# EAGLE design ui_board (EAGLE 8.7.1)
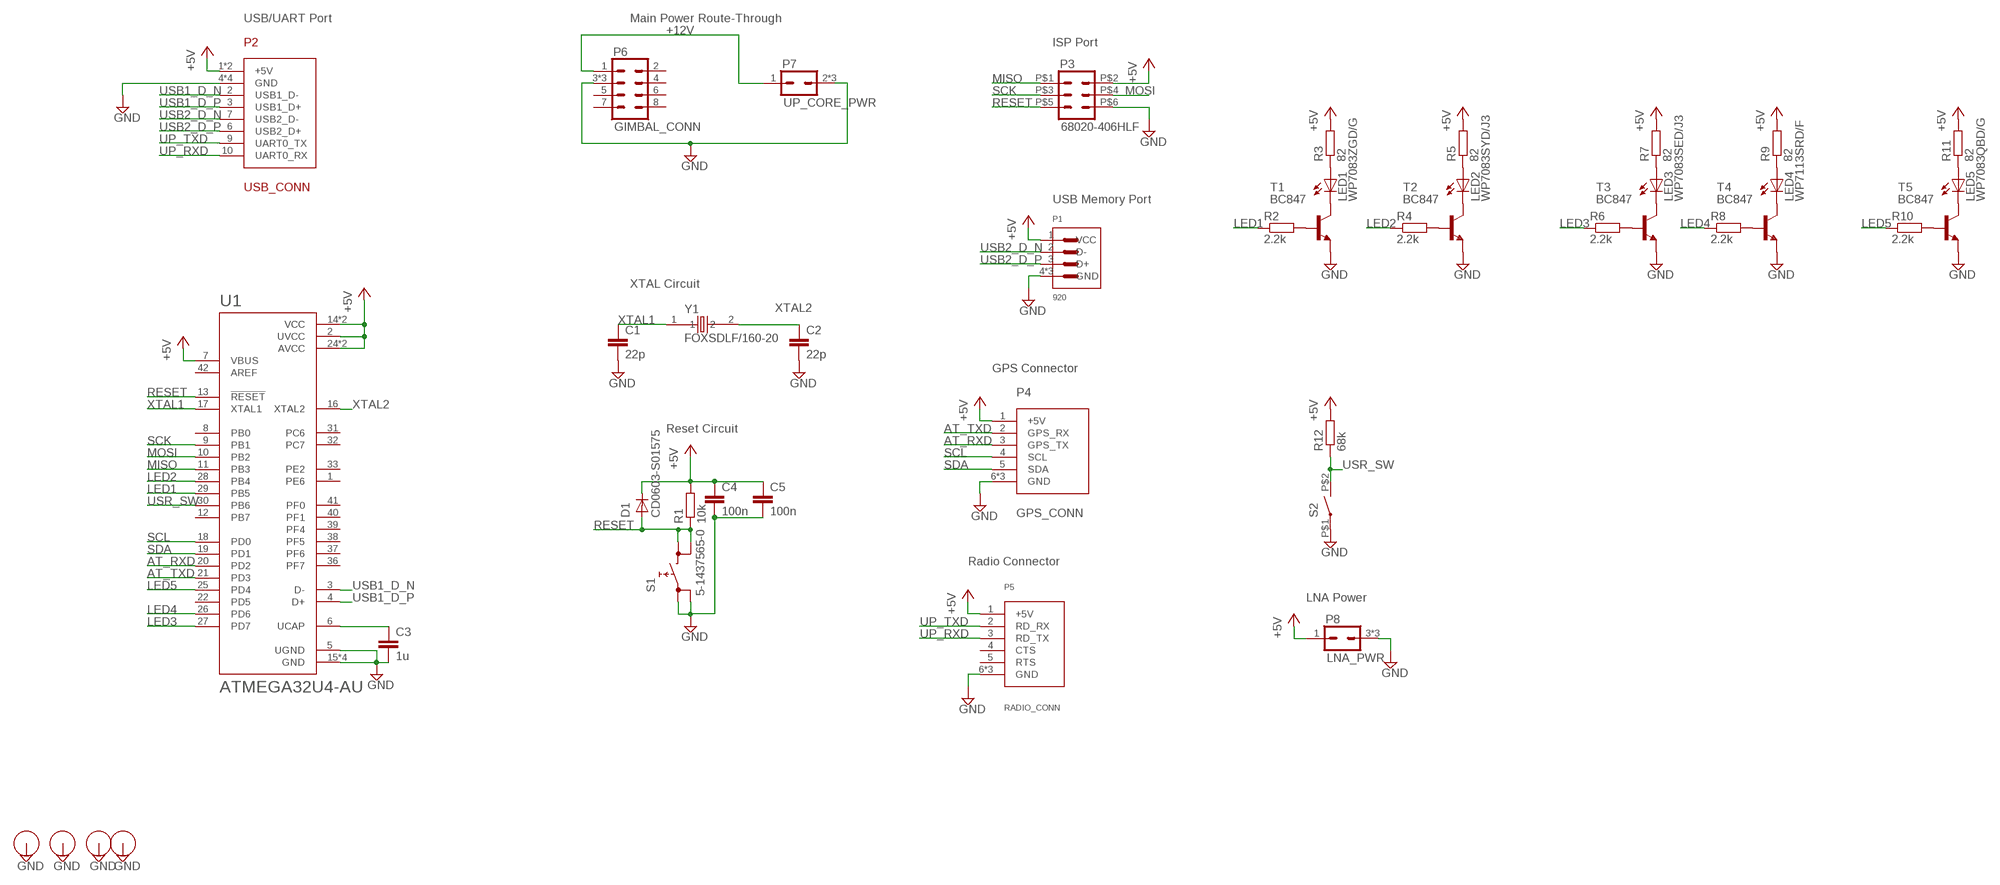
[diagram p0: schematic, sheet 1]

## Parts
C1  22p  C-EUC0805  [C0805]
C2  22p  C-EUC0805  [C0805]
C3  1u  C-EUC0805  [C0805]
C4  100n  C-EUC0805  [C0805]
C5  100n  C-EUC0805  [C0805]
D1  CD0603-S01575  [D0603]
LED1  WP7083ZGD/G  LED5MM  [LED5MM]
LED2  WP7083SYD/J3  LED5MM  [LED5MM]
LED3  WP7083SED/J3  LED5MM  [LED5MM]
LED4  WP7113SRD/F  LED5MM  [LED5MM]
LED5  WP7083QBD/G  LED5MM  [LED5MM]
P1  920  [USB_THRU]
P2  USB_CONN  [SM10B-SRSS-TB]
P3  68020-406HLF  [2X3_THRU]
P4  GPS_CONN  [SM06B-GHS-TB]
P5  RADIO_CONN  [DF13C-6P-1.25V]
P6  GIMBAL_CONN  [GIMBAL_CONN]
P7  UP_CORE_PWR  [SM02B-GHS-TB]
P8  LNA_PWR  [SM03B-GHS-TB]
R1  10k  R-EU_R0805  [R0805]
R2  2.2k  R-EU_R0805  [R0805]
R3  82  R-EU_R0805  [R0805]
R4  2.2k  R-EU_R0805  [R0805]
R5  82  R-EU_R0805  [R0805]
R6  2.2k  R-EU_R0805  [R0805]
R7  82  R-EU_R0805  [R0805]
R8  2.2k  R-EU_R0805  [R0805]
R9  82  R-EU_R0805  [R0805]
R10  2.2k  R-EU_R0805  [R0805]
R11  82  R-EU_R0805  [R0805]
R12  68k  R-EU_R0805  [R0805]
S1  5-1437565-0  [5-1437565-0]
S2  2267078-1  [2267078-1]
T1  BC847  [SOT23]
T2  BC847  [SOT23]
T3  BC847  [SOT23]
T4  BC847  [SOT23]
T5  BC847  [SOT23]
U1  ATMEGA32U4-AU  [QFP80P1200X1200X120-44N]
U$1  MOUNT_PAD  [MOUNT_PAD]
U$3  MOUNT_PAD  [MOUNT_PAD]
U$4  MOUNT_PAD  [MOUNT_PAD]
U$5  MOUNT_PAD  [MOUNT_PAD]
Y1  FOXSDLF/160-20  [XTAL1170X500X450]

## Nets
+5V: C4.1 C5.1 D1.P$1(C) P1.1(VCC) P2.1(+5V) P2.5(+5V) P3.P$2 P4.1(+5V) P5.1(+5V) P8.1 R1.2 R3.2 R5.2 R7.2 R9.2 R11.2 R12.2 U1.2(UVCC) U1.7(VBUS) U1.14(VCC) U1.24(AVCC) U1.34(VCC) U1.44(AVCC)
+12V: P6.1 P7.1
AT_RXD: P4.3(GPS_TX) U1.20(PD2)
AT_TXD: P4.2(GPS_RX) U1.21(PD3)
GND: C1.2 C2.2 C3.2 C4.2 C5.2 P1.4(GND) P1.5(GND) P1.6(GND) P2.4(GND) P2.8(GND) P2.G1(GND) P2.G2(GND) P3.P$6 P4.6(GND) P4.G1(GND) P4.G2(GND) P5.6(GND) P5.G1(GND) P5.G2(GND) P6.3 P6.GND@1 P6.GND@2 P7.2 P7.G1 P7.G2 P8.3 P8.G1 P8.G2 S1.P$1 S1.P$2 S2.P$1(P) T1.2(E) T2.2(E) T3.2(E) T4.2(E) T5.2(E) U1.5(UGND) U1.15(GND) U1.23(GND) U1.35(GND) U1.43(GND) U$1.P$1(GND) U$3.P$1(GND) U$4.P$1(GND) U$5.P$1(GND)
LED1: R2.1 U1.29(PB5)
LED2: R4.1 U1.28(PB4)
LED3: R6.1 U1.27(PD7)
LED4: R8.1 U1.26(PD6)
LED5: R10.1 U1.25(PD4)
MISO: P3.P$1 U1.11(PB3)
MOSI: P3.P$4 U1.10(PB2)
N$1: LED1.K(C) T1.3(C)
N$2: C3.1 U1.6(UCAP)
N$3: LED2.K(C) T2.3(C)
N$4: LED3.K(C) T3.3(C)
N$5: LED4.K(C) T4.3(C)
N$6: LED5.K(C) T5.3(C)
N$7: R2.2 T1.1(B)
N$8: LED1.A R3.1
N$9: R4.2 T2.1(B)
N$10: LED2.A R5.1
N$11: R6.2 T3.1(B)
N$12: LED3.A R7.1
N$13: R8.2 T4.1(B)
N$14: LED4.A R9.1
N$15: R10.2 T5.1(B)
N$16: LED5.A R11.1
RESET: D1.P$2(A) P3.P$5 R1.1 S1.P$3 S1.P$4 U1.13(!RESET)
SCK: P3.P$3 U1.9(PB1)
SCL: P4.4(SCL) U1.18(PD0)
SDA: P4.5(SDA) U1.19(PD1)
UP_RXD: P2.10(UART0_RX) P5.3(RD_TX)
UP_TXD: P2.9(UART0_TX) P5.2(RD_RX)
USB1_D_N [USB]: P2.2(USB1_D-) U1.3(D-)
USB1_D_P [USB]: P2.3(USB1_D+) U1.4(D+)
USB2_D_N [USB]: P1.2(D-) P2.7(USB2_D-)
USB2_D_P [USB]: P1.3(D+) P2.6(USB2_D+)
USR_SW: R12.1 S2.P$2(S) U1.30(PB6)
XTAL1: C1.1 U1.17(XTAL1) Y1.1
XTAL2: C2.1 U1.16(XTAL2) Y1.2
Unconnected: P5.4(CTS) P5.5(RTS) P6.2 P6.4 P6.5 P6.6 P6.7 P6.8 U1.1(PE6) U1.8(PB0) U1.12(PB7) U1.22(PD5) U1.31(PC6) U1.32(PC7) U1.33(PE2) U1.36(PF7) U1.37(PF6) U1.38(PF5) U1.39(PF4) U1.40(PF1) U1.41(PF0) U1.42(AREF)

## Notes on the sheet
- USB/UART Port | Main Power Route-Through
- ISP Port
- USB Memory Port
- XTAL Circuit
- GPS Connector
- Reset Circuit
- Radio Connector
- LNA Power

## Library data of the parts
C1 C2 = resistor:C-EU: CAPACITOR, European symbol
C3-C5 = rcl:C-EU: CAPACITOR, European symbol; SPICEPREFIX: C
D1 = rct_ui_board:CD0603-S01575
LED1-LED5 = led:LED: LED OSRAM: - CHIPLED LG R971, LG N971, LY N971, LG Q971, LY Q971, LO R971, LY R971 LH N974, LH R974 LS Q976, LO Q976, LY Q976 LO Q996 - Hyper CHIPLED LW Q18S LB Q993, LB Q99A, LB R99A - SideLED LS A670, LO A670, LY A670, LG A670, LP A670 LB A673, LV A673, LT A673, LW A673 LH A674 LY A675 LS A676, LA A676, LO A676, LY A676, LW A676 LS A679, LY A679, LG A679 - Hyper Micro SIDELED® LS Y876, LA Y876, LO Y876, LY Y876 LT Y87S - SmartLED LW L88C, LW L88S LB L89C, LB L89S, LG L890 LS L89K, LO L89K, LY L89K LS L896, LA L896, LO L896, LY L896 - TOPLED LS T670, LO T670, LY T670, LG T670, LP T670 LSG T670, LSP T670, LSY T670, LOP T670, LYG T670 LG T671, LOG T671, LSG T671 LB T673, LV T673, LT T673, LW T673 LH T674 LS T676, LA T676, LO T676, LY T676, LB T676, LH T676, LSB T676, LW T676 LB T67C, LV T67C, LT T67C, LS T67K, LO T67K, LY T67K, LW E67C LS E67B, LA E67B, LO E67B, LY E67B, LB E67C, LV E67C, LT E67C LW T67C LS T679, LY T679, LG T679 LS T770, LO T770, LY T770, LG T770, LP T770 LB T773, LV T773, LT T773, LW T773 LH T774 LS E675, LA E675, LY E675, LS T675 LS T776, LA T776, LO T776, LY T776, LB T776 LHGB T686 LT T68C, LB T68C - Hyper Mini TOPLED® LB M676 - Mini TOPLED Santana® LG M470 LS M47K, LO M47K, LY M47K Source: http://www.osram.convergy.de LUXEON: - LUMILED® LXK2-PW12-R00, LXK2-PW12-S00, LXK2-PW14-U00, LXK2-PW14-V00 LXK2-PM12-R00, LXK2-PM12-S00, LXK2-PM14-U00 LXK2-PE12-Q00, LXK2-PE12-R00, LXK2-PE12-S00, LXK2-PE14-T00, LXK2-PE14-U00 LXK2-PB12-K00, LXK2-PB12-L00, LXK2-PB12-M00, LXK2-PB14-N00, LXK2-PB14-P00, LXK2-PB14-Q00 LXK2-PR12-L00, LXK2-PR12-M00, LXK2-PR14-Q00, LXK2-PR14-R00 LXK2-PD12-Q00, LXK2-PD12-R00, LXK2-PD12-S00 LXK2-PH12-R00, LXK2-PH12-S00 LXK2-PL12-P00, LXK2-PL12-Q00, LXK2-PL12-R00 Source: www.luxeon.com KINGBRIGHT: KA-3528ASYC Source: www.kingbright.com
P1 = rct_ui_board:920
P2 = rct_ui_board:USB_CONN
P3 = rct_ui_board:68020-406HLF
P4 = rct_ui_board:GPS_CONN
P5 = rct_ui_board:RADIO_CONN
P6 = rct_ui_board:GIMBAL_CONN
P7 = rct_ui_board:UP_CORE_PWR
P8 = rct_ui_board:LNA_PWR
R1-R12 = rcl:R-EU_: RESISTOR, European symbol; SPICEPREFIX: R
S1 = rct_ui_board:5-1437565-0
S2 = rct_ui_board:2267078-1
T1-T5 = transistor:BC847: NPN TRANSISTOR
U1 = Common-Parts-Library-Eagle:ATMEGA32U4-AU: ATmega Series 16 MHz 32 KB Flash 2.5 KB SRAM 8-Bit Microcontroller - TQFP-44; MANUFACTURER: Atmel
U$1 U$3-U$5 = rct_ui_board:MOUNT_PAD
Y1 = Common-Parts-Library-Eagle:FOXSDLF/160-20: Microprocessor, Crystal; 16 Mhz; + 30 Ppm @ Degc; 7 Pf (Max.); 20 Pf; -20 Deg; MANUFACTURER: Fox Electronics

## Board
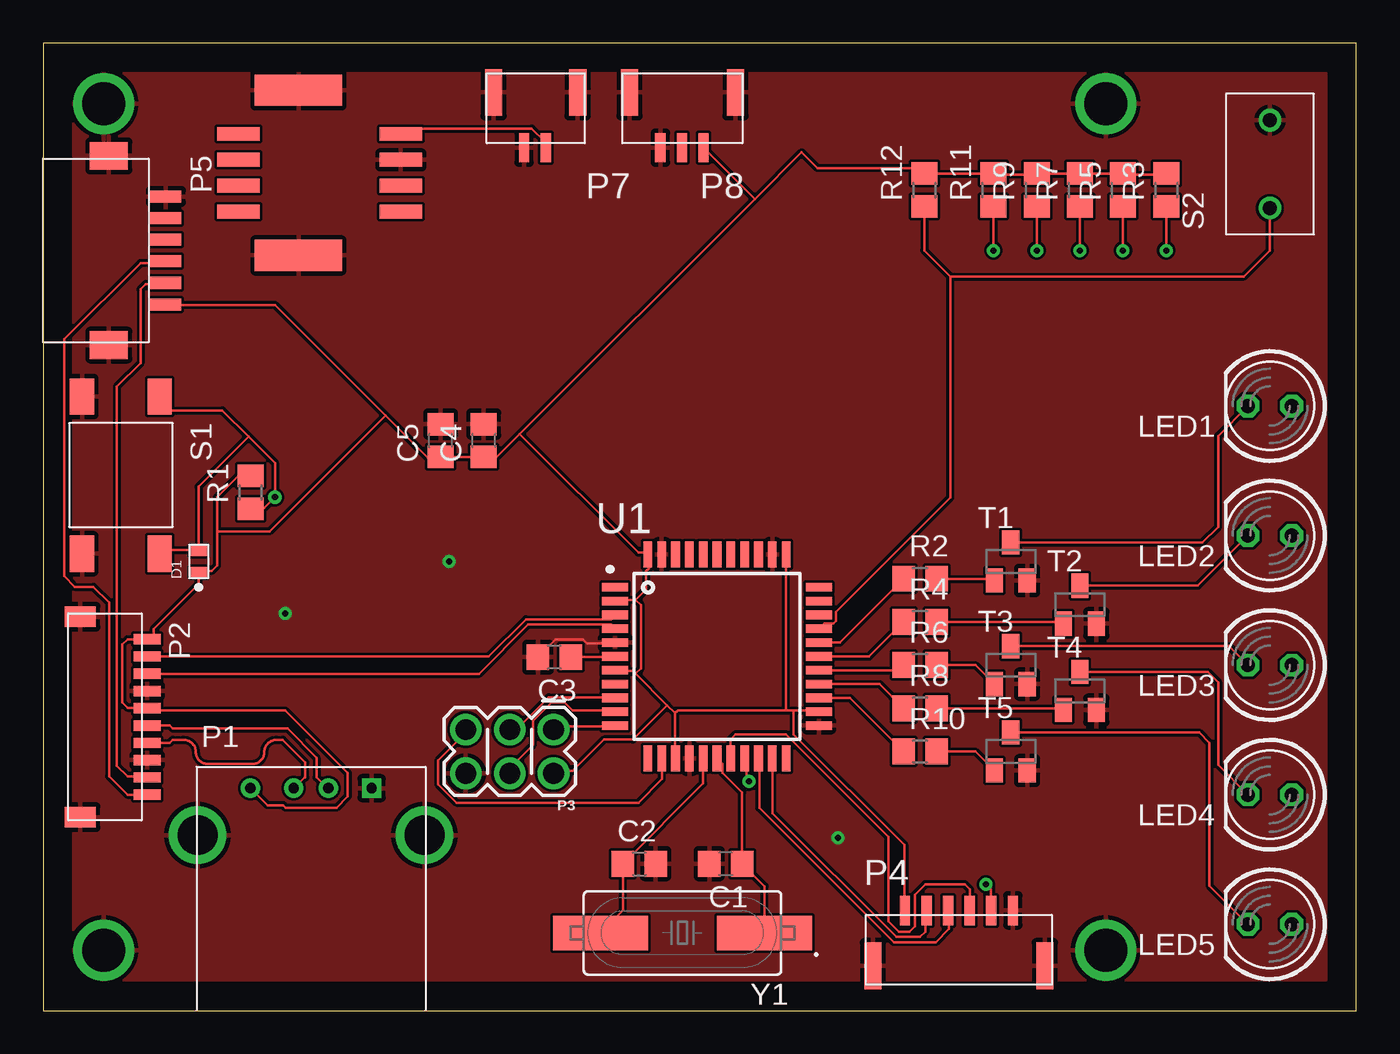
[diagram p1: board, top side]
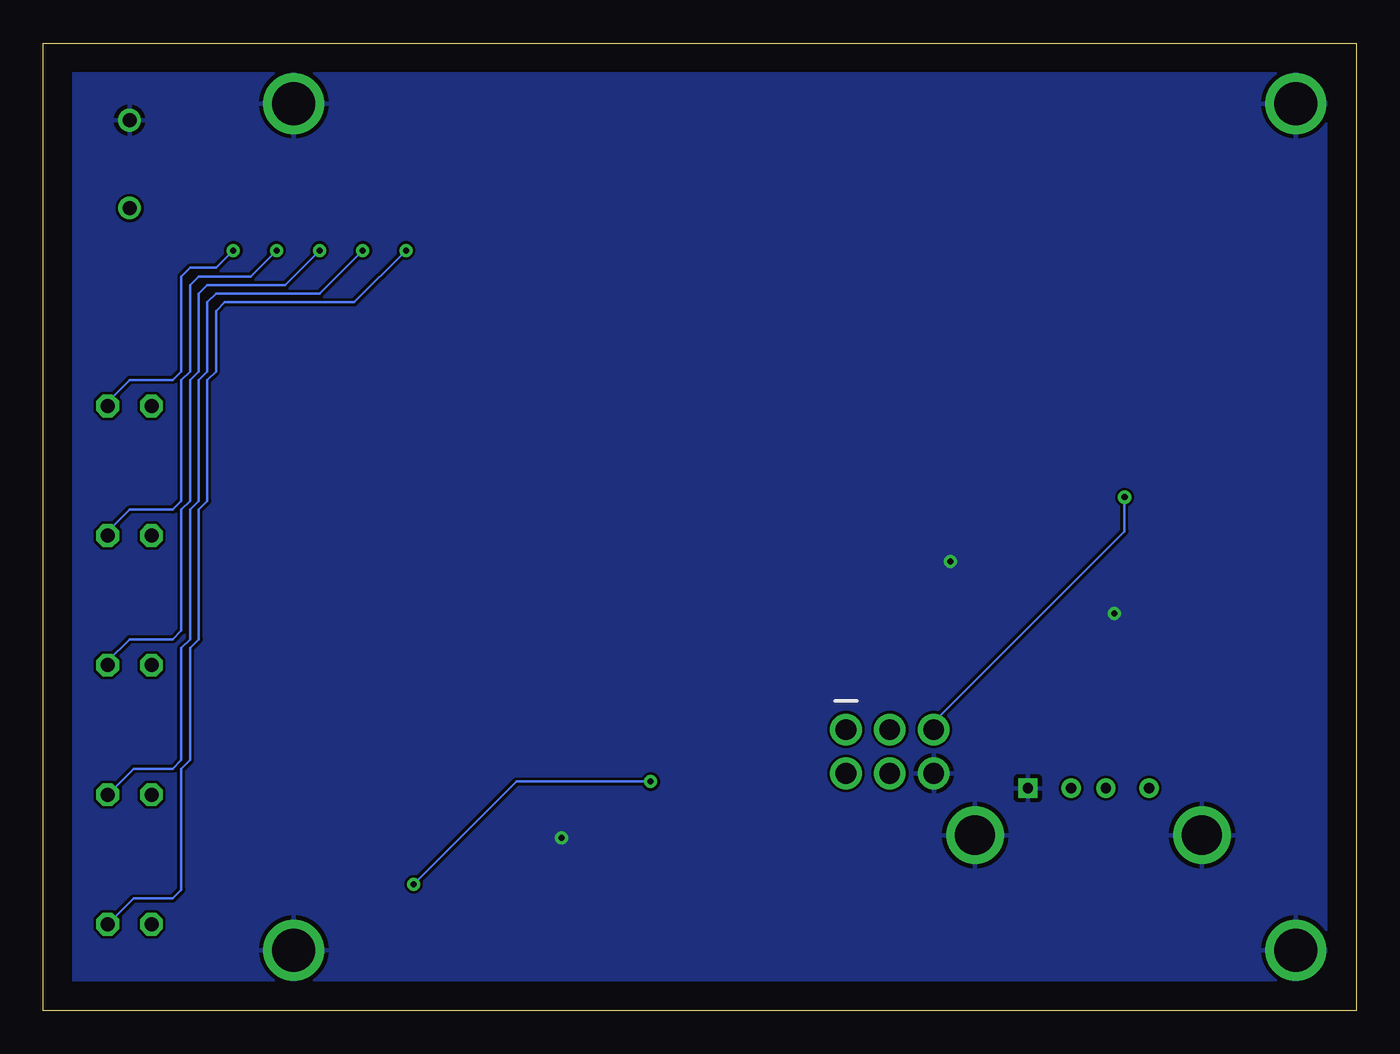
[diagram p2: board, bottom side, seen from below]

Size 76 x 56 mm. Coordinates in mm from the lower left corner, seen from the top.
Outline: 0,0 76,0 76,56 0,56 0,0
Copper layers (1*16): Top 0.035mm / dielectric 1.5mm / Bottom 0.035mm
Design rules "default *": minimum track width 6mil, minimum drill 12mil, track to track 6mil, track to pad 6mil, pad to pad 6mil, via to via 6mil, smd to smd 6mil, copper to edge 40mil, drill to drill 6mil, minimum pad ring 10mil, minimum via ring 8mil, stop-mask expansion 4mil, vias tented up to drill 0mil, thermal gap 10mil

### Footprints (pad centres in the part's own frame; a part is rotated, then mirrored left to right if it is on the bottom)
C0805 = smd 1.3 x 1.5: 1 -0.95,0; 2 0.95,0
D0603 = smd 0.6 x 1: P$1 -0.625,0; P$2 0.625,0
LED5MM = drill 0.813 octagon: A -1.27,0; K 1.27,0
USB_THRU = drill 0.6: 1 -3.505,12.878; 2 -1.003,12.878; 3 1.003,12.878 | drill 0.6 square: 4 3.505,12.878 | drill 2.311: 5 -6.566,10.16; 6 6.566,10.16
SM10B-SRSS-TB = smd 0.6 x 1.55: 1 -4.5,4.775; 2 -3.5,4.775; 3 -2.5,4.775; 4 -1.5,4.775; 5 -0.5,4.775; 6 0.5,4.775; 7 1.5,4.775; 8 2.5,4.775; 9 3.5,4.775; 10 4.5,4.775 | smd 1.2 x 1.8: G1 -5.8,0.9; G2 5.8,0.9
2X3_THRU = drill 1.2 pad 1.829: P$1 -2.54,-1.27; P$2 -2.54,1.27; P$3 0,-1.27; P$4 0,1.27; P$5 2.54,-1.27; P$6 2.54,1.27
SM06B-GHS-TB = smd 0.6 x 1.7: 1 -3.125,4.55; 2 -1.875,4.55; 3 -0.625,4.55; 4 0.625,4.55; 5 1.875,4.55; 6 3.125,4.55 | smd 1 x 2.7: G1 -4.975,1.35; G2 4.975,1.35
DF13C-6P-1.25V = smd 0.7 x 1.8: 1 3.125,7.1; 2 1.875,7.1; 3 0.625,7.1; 4 -0.625,7.1; 5 -1.875,7.1; 6 -3.125,7.1 | smd 1.6 x 2.2: G1 5.475,3.8; G2 -5.475,3.8
GIMBAL_CONN = smd 0.8 x 2.45: 1 2.25,-4.7; 2 2.25,4.7; 3 0.75,-4.7; 4 0.75,4.7; 5 -0.75,-4.7; 6 -0.75,4.7; 7 -2.25,-4.7; 8 -2.25,4.7 | smd 1.8 x 5.05: GND@1 4.78,1.225; GND@2 -4.78,1.225
SM02B-GHS-TB = smd 0.6 x 1.7: 1 -0.585,4.55; 2 0.665,4.55 | smd 1 x 2.7: G1 -2.435,1.35; G2 2.435,1.35
SM03B-GHS-TB = smd 0.6 x 1.7: 1 -1.22,4.55; 2 0.03,4.55; 3 1.28,4.55 | smd 1 x 2.7: G1 -3.07,1.35; G2 3.07,1.35
R0805 = smd 1.3 x 1.5: 1 -0.95,0; 2 0.95,0
5-1437565-0 = smd 1.4 x 2.1: P$1 2.25,4.55; P$2 2.25,-4.55; P$3 -2.25,4.55; P$4 -2.25,-4.55
2267078-1 = drill 0.8: P$1 0,2.54; P$2 0,-2.54
SOT23 = smd 1 x 1.4: 1 -0.95,-1.1; 2 0.95,-1.1; 3 0,1.1
QFP80P1200X1200X120-44N = smd 1.5 x 0.5: 1 -5.9,4; 2 -5.9,3.2; 3 -5.9,2.4; 4 -5.9,1.6; 5 -5.9,0.8; 6 -5.9,0; 7 -5.9,-0.8; 8 -5.9,-1.6; 9 -5.9,-2.4; 10 -5.9,-3.2; 11 -5.9,-4; 23 5.9,-4; 24 5.9,-3.2; 25 5.9,-2.4; 26 5.9,-1.6; 27 5.9,-0.8; 28 5.9,0; 29 5.9,0.8; 30 5.9,1.6; 31 5.9,2.4; 32 5.9,3.2; 33 5.9,4 | smd 0.5 x 1.5: 12 -4,-5.9; 13 -3.2,-5.9; 14 -2.4,-5.9; 15 -1.6,-5.9; 16 -0.8,-5.9; 17 0,-5.9; 18 0.8,-5.9; 19 1.6,-5.9; 20 2.4,-5.9; 21 3.2,-5.9; 22 4,-5.9; 34 4,5.9; 35 3.2,5.9; 36 2.4,5.9; 37 1.6,5.9; 38 0.8,5.9; 39 0,5.9; 40 -0.8,5.9; 41 -1.6,5.9; 42 -2.4,5.9; 43 -3.2,5.9; 44 -4,5.9
MOUNT_PAD = drill 2.5: P$1 0,0
XTAL1170X500X450 = smd 5.5 x 2: 1 -4.75,0; 2 4.75,0

### Placement (x,y rotation side)
C1  39.5,8.5 180 top
C2  34.5,8.5 0 top
C3  29.59,20.46 180 top
C4  25.5,33 90 top
C5  23,33 90 top
D1  9,26 90 top
LED1  71,35 180 top
LED2  71,27.5 180 top
LED3  71,20 180 top
LED4  71,12.5 180 top
LED5  71,5 180 top
P1  15.5,0 0 top
P2  1.25,17 270 top
P3  27,15 180 top
P4  53,1.25 0 top
P5  0,44 270 top
P6  16,48.5 90 top
P7  28.5,54.5 180 top
P8  37,54.5 180 top
R1  12,30 90 top
R2  50.75,25 0 top
R3  65,47.5 90 top
R4  50.75,22.5 0 top
R5  62.5,47.5 90 top
R6  50.75,20 0 top
R7  60,47.5 90 top
R8  50.75,17.5 0 top
R9  57.5,47.5 90 top
R10  50.75,15 0 top
R11  55,47.5 90 top
R12  51,47.5 90 top
S1  4.5,31 180 top
S2  71,49 0 top
T1  56,26 0 top
T2  60,23.5 0 top
T3  56,20 0 top
T4  60,18.5 0 top
T5  56,15 0 top
U1  39,20.5 0 top
U$1  3.5,3.5 0 top
U$3  61.5,3.5 0 top
U$4  3.5,52.5 0 top
U$5  61.5,52.5 0 top
Y1  37,4.5 180 top

### Tracks (layer width: path | path; a pad name or v marks a point on that pad's centre or on a via)
+5V
  Top 0.152: 55.07,48.38 57.51,48.38 R9.2 57.66,48.43 60.1,48.43 | 55.07,48.38 R11.2 | R3.2 65.13,48.38 62.69,48.38 R5.2 62.54,48.43 60.1,48.43 | 60.1,48.43 R7.2 | 55.07,48.38 R11.2 R12.2 50.9,48.46 50.6,48.77 44.81,48.77 43.89,49.68 41.19,46.98 | 34.29,23.77 33.22,23.77 U1.2 | 34.29,23.77 34.9,24.38 34.9,25.45 35.05,25.6 35.05,26.36 U1.44 34.9,26.52 34.44,26.52 27.58,33.38 | 36.58,17.22 36.58,14.63 U1.14 | 34.29,19.51 34.14,19.66 33.22,19.66 U1.7 | 34.29,19.51 36.12,17.68 | 36.12,17.68 36.58,17.22 | 42.98,17.37 36.73,17.37 36.58,17.22 | 42.98,17.37 43.43,17.37 | 43.43,17.37 44.81,17.37 U1.24 | 42.98,17.37 42.98,26.36 U1.34 | 43.43,17.37 43.43,16 49.84,9.6 49.84,5.94 P4.1 | 34.29,23.77 34.59,23.47 34.59,19.81 34.29,19.51 | 36.12,17.68 34.14,15.7 32.46,15.7 30.63,13.87 29.57,13.87 P3.P$2 | 10.06,27.74 10.06,25.76 9.75,25.45 9.14,25.45 D1.P$1 8.99,25.3 8.99,24.69 6.4,22.1 6.4,21.64 6.25,21.49 6.1,21.49 P2.1 5.94,21.49 4.88,21.49 4.57,21.18 4.57,17.83 4.88,17.53 5.94,17.53 P2.5 6.15,17.38 14.01,17.38 17.63,13.75 17.63,12.41 16.97,11.75 14.03,11.75 13.89,11.89 12.98,11.89 P1.1 | 10.06,27.74 10.06,29.72 11.28,30.94 11.89,30.94 R1.2 | 19.81,34.44 22.25,32 22.86,32 C5.1 C4.1 25.6,32 26.21,32 27.58,33.38 | 19.81,34.44 13.41,40.84 7.16,40.84 P5.1 | 27.58,33.38 41.19,46.98 | 10.06,27.74 13.11,27.74 19.81,34.44 | 41.19,46.98 38.25,49.91 P8.1
+12V
  Top 0.152: P7.1 29.03,49.99 29.03,50.29 28.27,51.05 20.95,51.05 20.73,50.83 P6.1
AT_RXD
  Top 0.152: U1.20 41.45,14.48 41.45,11.73 49.23,3.96 51.66,3.96 52.43,4.72 52.43,5.79 P4.3
AT_TXD
  Top 0.152: U1.21 42.22,14.48 42.22,11.43 49.38,4.27 50.75,4.27 51.05,4.57 51.05,5.79 P4.2
GND  (via drill 0.35)
  Top 0.152: U1.5 33.07,21.26 31.47,21.26 31.24,21.49 29.64,21.49 28.65,20.5 C3.2
  other vias: 23.5,26 14,23 46,10
  pour Top: 1.75,54.25 74.25,54.25 74.25,1.75 1.75,1.75
  pour Bottom: 1.75,54.25 1.75,1.75 74.25,1.75 74.25,54.25
LED1
  Top 0.152: U1.29 46.1,21.3 R2.1
LED2
  Top 0.152: U1.28 47.8,20.5 R4.1
LED3
  Top 0.152: U1.27 49.5,19.7 R6.1
LED4
  Top 0.152: U1.26 48.4,18.9 R8.1
LED5
  Top 0.152: U1.25 46.7,18.1 R10.1
MISO
  Top 0.152: U1.11 33.07,16.46 29.72,16.46 29.57,16.31 P3.P$1
MOSI
  Top 0.152: U1.10 33.07,17.37 30.63,17.37 30.18,17.83 29.41,17.83 28.35,16.76 28.35,15.39 27.13,14.17 27.13,13.87 P3.P$4
N$1
  Top 0.152: T1.3 67.1,27.1 68,28 68,33.27 LED1.K
N$2
  Top 0.152: C3.1 33.06,20.46 U1.6
N$3
  Top 0.152: T2.3 66.83,24.6 LED2.K
N$4
  Top 0.152: T3.3 68.63,21.1 LED3.K
N$5
  Top 0.152: T4.3 67.4,19.6 68,19 68,14.23 LED4.K
N$6
  Top 0.152: T5.3 66.9,16.1 67.5,15.5 67.5,7.23 LED5.K
N$7
  Top 0.152: R2.2 54.95,25 T1.1
N$8  (via drill 0.35)
  Top 0.152: R3.1 v65,44
  Bottom 0.152: v65,44 66,43 67.5,43 68,42.5 68,37 68.5,36.5 71,36.5 72.27,35.23 LED1.A
N$9
  Top 0.152: R4.2 58.95,22.5 T2.1
N$10  (via drill 0.35)
  Top 0.152: R5.1 v62.5,44
  Bottom 0.152: v62.5,44 64,42.5 67,42.5 67.5,42 67.5,37 68,36.5 68,29.5 68.5,29 71,29 72.27,27.73 LED2.A
N$11
  Top 0.152: R6.2 53.95,20 T3.1
N$12  (via drill 0.35)
  Top 0.152: R7.1 v60,44
  Bottom 0.152: v60,44 62,42 66.5,42 67,41.5 67,37 67.5,36.5 67.5,29.5 68,29 68,22 68.5,21.5 71,21.5 72.27,20.23 LED3.A
N$13
  Top 0.152: R8.2 58.95,17.5 T4.1
N$14  (via drill 0.35)
  Top 0.152: R9.1 v57.5,44
  Bottom 0.152: v57.5,44 60,41.5 66,41.5 66.5,41 66.5,37 67,36.5 67,29.5 67.5,29 67.5,21.5 68,21 68,14.5 68.5,14 70.77,14 LED4.A
N$15
  Top 0.152: R10.2 53.95,15 T5.1
N$16  (via drill 0.35)
  Top 0.152: R11.1 v55,44
  Bottom 0.152: LED5.A 70.77,6.5 68.5,6.5 68,7 68,14 67.5,14.5 67.5,21 67,21.5 67,29 66.5,29.5 66.5,36.5 66,37 66,40.5 65.5,41 58,41 v55,44
RESET  (via drill 0.35)
  Top 0.152: 8.99,26.67 7.01,26.67 6.86,26.52 S1.P$3 | 11.89,33.22 10.36,34.75 7.47,34.75 6.71,35.51 S1.P$4 | 11.89,33.22 13.41,31.7 v13.41,29.72 12.8,29.11 12.04,29.11 R1.1 | 8.99,26.67 8.99,30.33 11.89,33.22 | 8.99,26.67 D1.P$2 | U1.13 35.81,14.48 35.81,13.41 34.44,12.04 23.93,12.04 22.86,13.11 22.86,14.48 24.54,16.15 P3.P$5
  Bottom 0.152: v13.41,29.72 13.41,27.74 24.38,16.76 24.38,16.31 P3.P$5
SCK
  Top 0.152: U1.9 33.07,18.14 29.26,18.14 27.43,16.31 27.13,16.31 P3.P$3
SCL
  Top 0.152: U1.18 39.78,14.63 39.78,15.7 40.08,16 42.98,16 48.92,10.06 48.92,5.18 49.53,4.57 50.14,4.57 50.44,4.88 50.44,6.71 51.05,7.32 53.34,7.32 53.65,7.01 53.65,5.94 P4.4
SDA  (via drill 0.35)
  Top 0.152: v40.84,13.26 40.69,13.41 40.69,14.48 U1.19 | v54.56,7.32 54.86,7.01 54.86,5.94 P4.5
  Bottom 0.152: v40.84,13.26 48.62,13.26 v54.56,7.32
UP_RXD
  Top 0.152: P2.10 5.94,12.5 4.88,12.5 3.81,13.56 3.81,23.62 2.9,24.54 1.83,24.54 1.22,25.15 1.22,38.86 5.64,43.28 7.01,43.28 P5.3
UP_TXD
  Top 0.152: P2.9 5.94,13.56 4.88,13.56 4.27,14.17 4.27,36.12 5.64,37.49 5.64,41.76 5.94,42.06 7.01,42.06 P5.2
USB1_D_N
  Top 0.152: P2.2 25.78,20.5 27.94,22.65 32.85,22.65 U1.3
USB1_D_P
  Top 0.152: P2.3 25.22,19.5 28.06,22.35 32.85,22.35 U1.4
USB2_D_N
  Top 0.152: P1.2 15.12,13.5 15.17,13.5 15.17,14.37 13.87,15.67 13.5,15.67 arc90 12.8,14.97 arc-90 12.1,14.27 9.53,14.27 arc-90 8.83,14.97 arc90 8.13,15.67 7.5,15.67 7.33,15.5 P2.7
USB2_D_P
  Top 0.152: P1.3 16.45,12.88 15.83,13.5 15.83,14.63 14.13,16.33 7.5,16.33 7.33,16.5 P2.6
USR_SW
  Top 0.152: R12.1 51,44 52.5,42.5 | 52.5,42.5 69.5,42.5 71,44 S2.P$2 | 52.5,42.5 52.5,29.7 45.88,23.08 45.88,22.55 45.74,22.42 45.22,22.42 U1.30
XTAL1
  Top 0.152: Y1.1 41.75,7.2 C1.1 40.45,12.63 39.32,13.76 39.32,14.28 U1.17
XTAL2
  Top 0.152: Y1.2 33.55,5.8 C2.1 38.2,13.15 U1.16